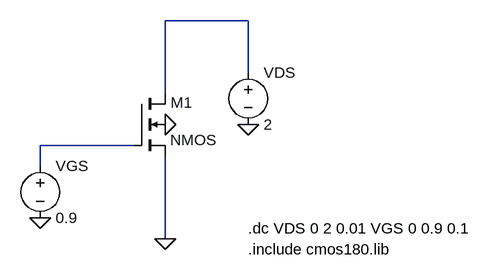
[diagram p0: schematic lamdaN.asc]
lamdaN.asc, the LTspice schematic file:
Version 4.1
SHEET 1 880 680
WIRE 304 128 176 128
WIRE 304 208 304 128
WIRE 176 240 176 128
WIRE 128 320 -16 320
WIRE -16 352 -16 320
WIRE 176 464 176 336
FLAG 176 464 0
FLAG -16 432 0
FLAG 304 288 0
FLAG 176 288 0
SYMBOL nmos4 128 240 R0
WINDOW 0 57 14 Left 2
SYMATTR InstName M1
SYMATTR Value2 l=1u w=1u
SYMBOL voltage -16 336 R0
WINDOW 123 0 0 Left 2
WINDOW 39 0 0 Left 2
SYMATTR InstName VGS
SYMATTR Value 0.9
SYMBOL voltage 304 192 R0
WINDOW 123 0 0 Left 0
WINDOW 39 0 0 Left 0
SYMATTR InstName VDS
SYMATTR Value 2
TEXT 304 480 Left 2 !.include cmos180.lib
TEXT 304 448 Left 2 !.dc VDS 0 2 0.01 VGS 0 0.9 0.1

The netlist it stands for:
* lamdaN.asc
M1 N001 N002 0 0 NMOS l=1u w=1u
VGS N002 0 0.9
VDS N001 0 2
.model NMOS NMOS
.model PMOS PMOS
.lib standard.mos
.include cmos180.lib
.dc VDS 0 2 0.01 VGS 0 0.9 0.1
.backanno
.end